# EAGLE design sk6812-24-12ring-out (EAGLE 7.5.0)
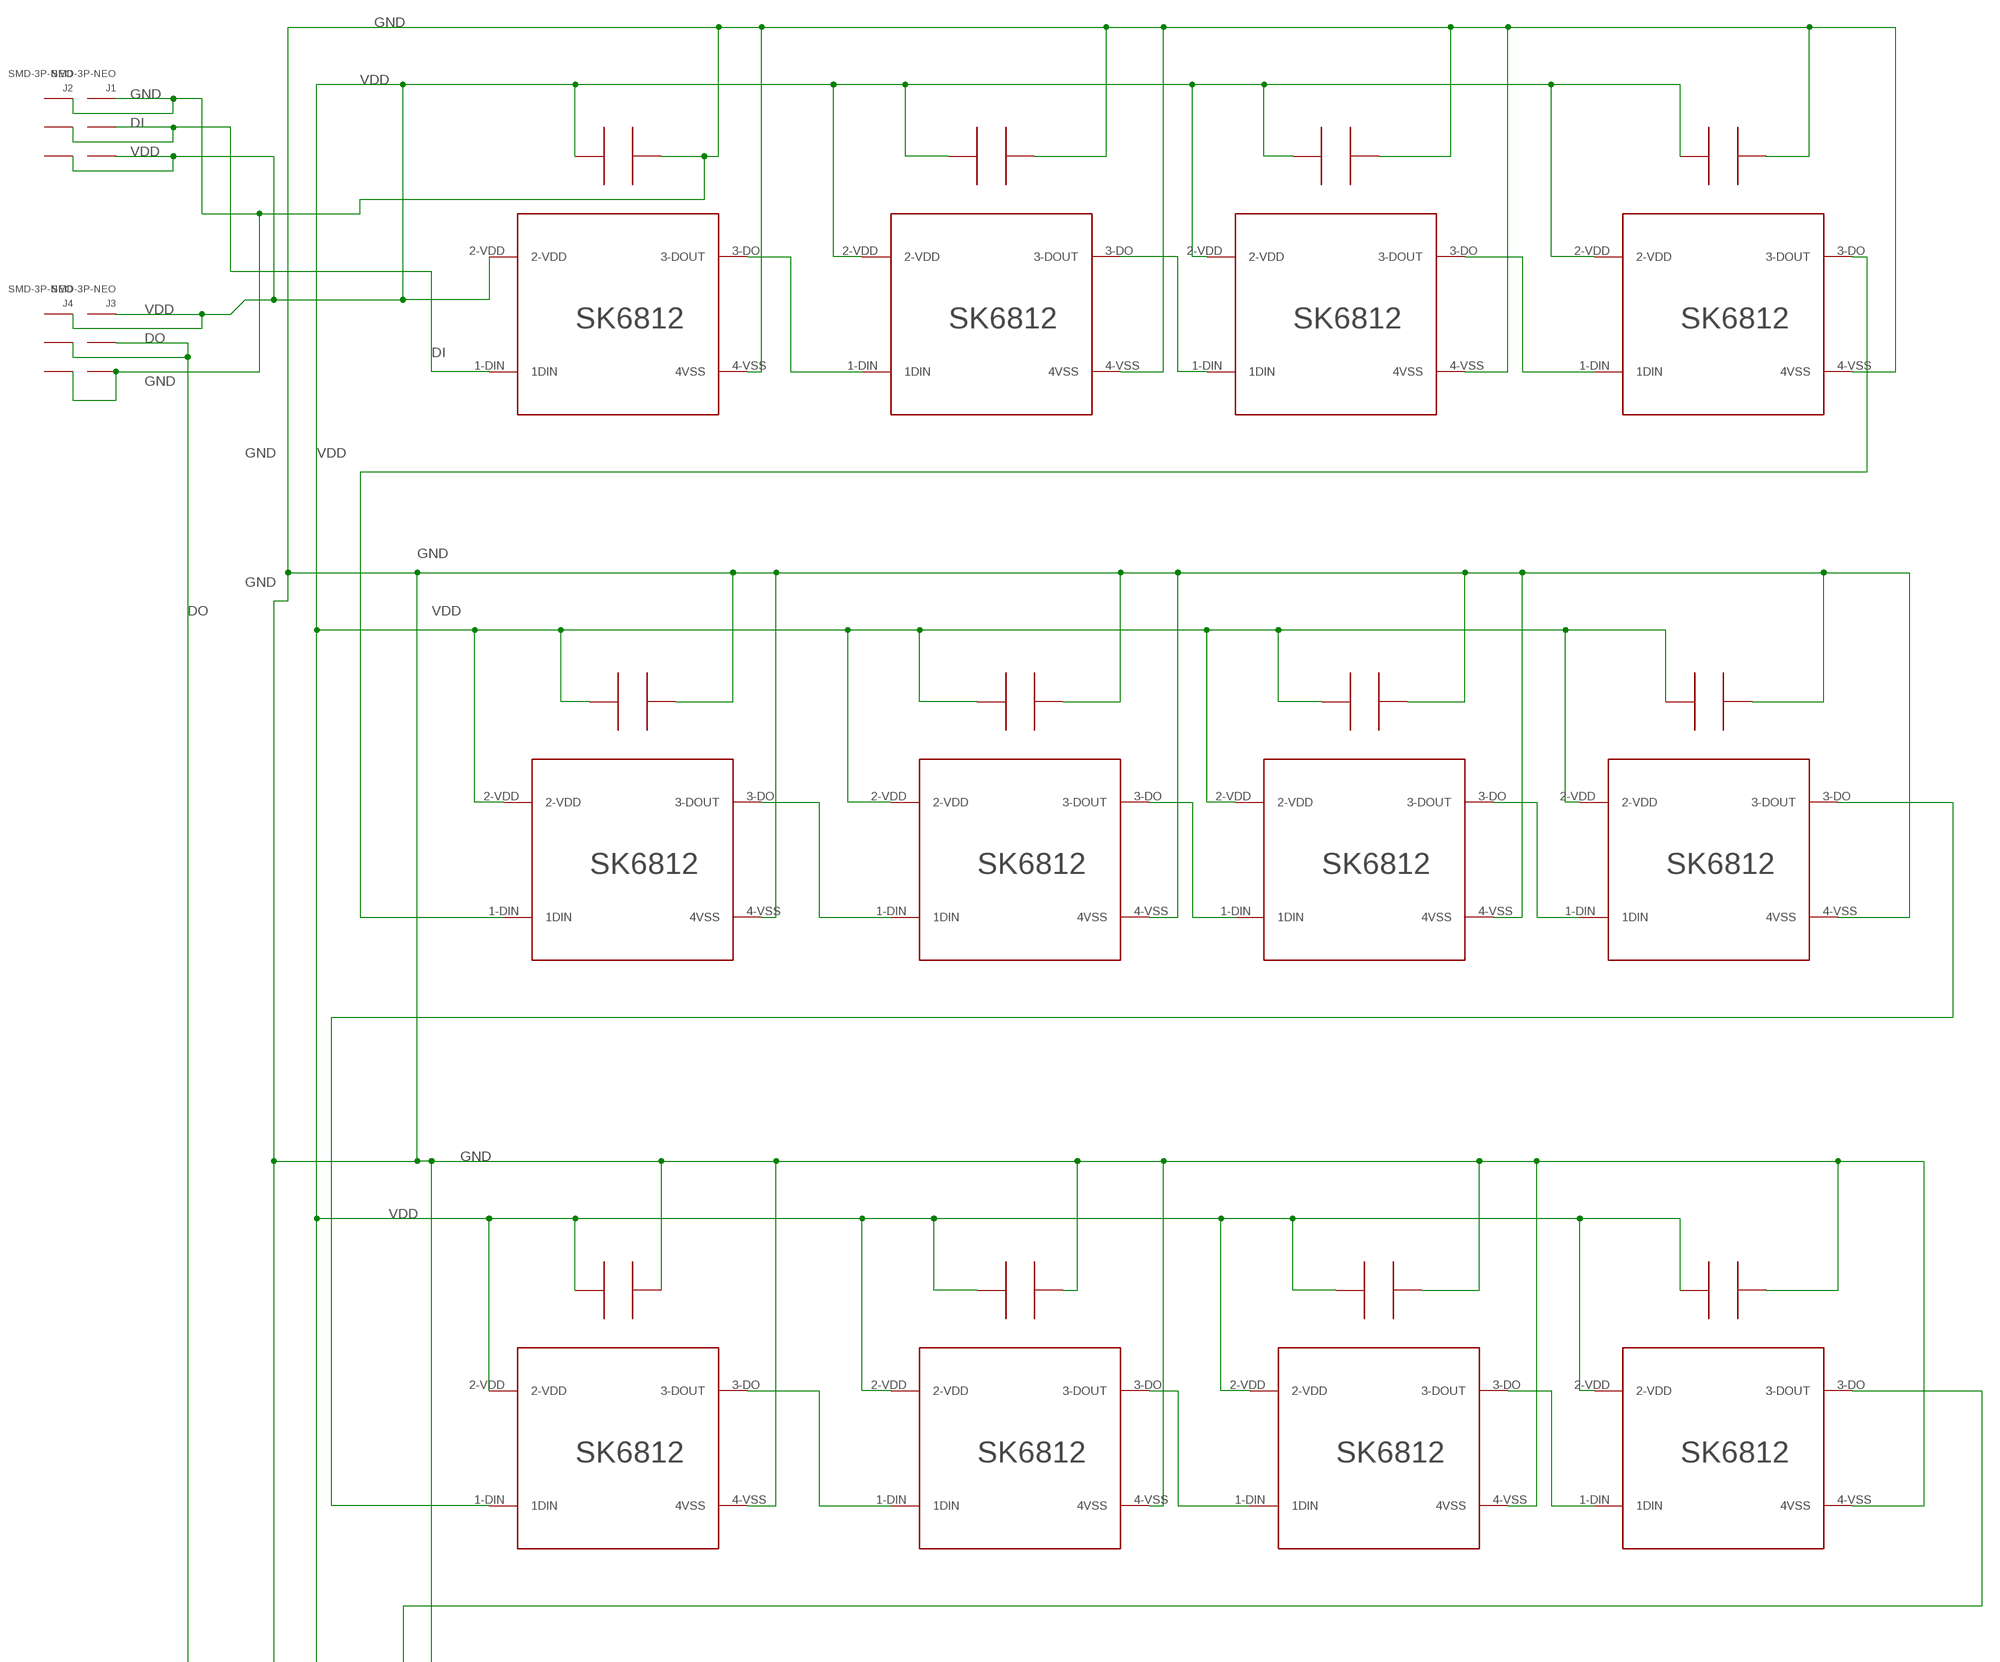
[diagram p0: schematic, sheet 1, part 1 of 2]
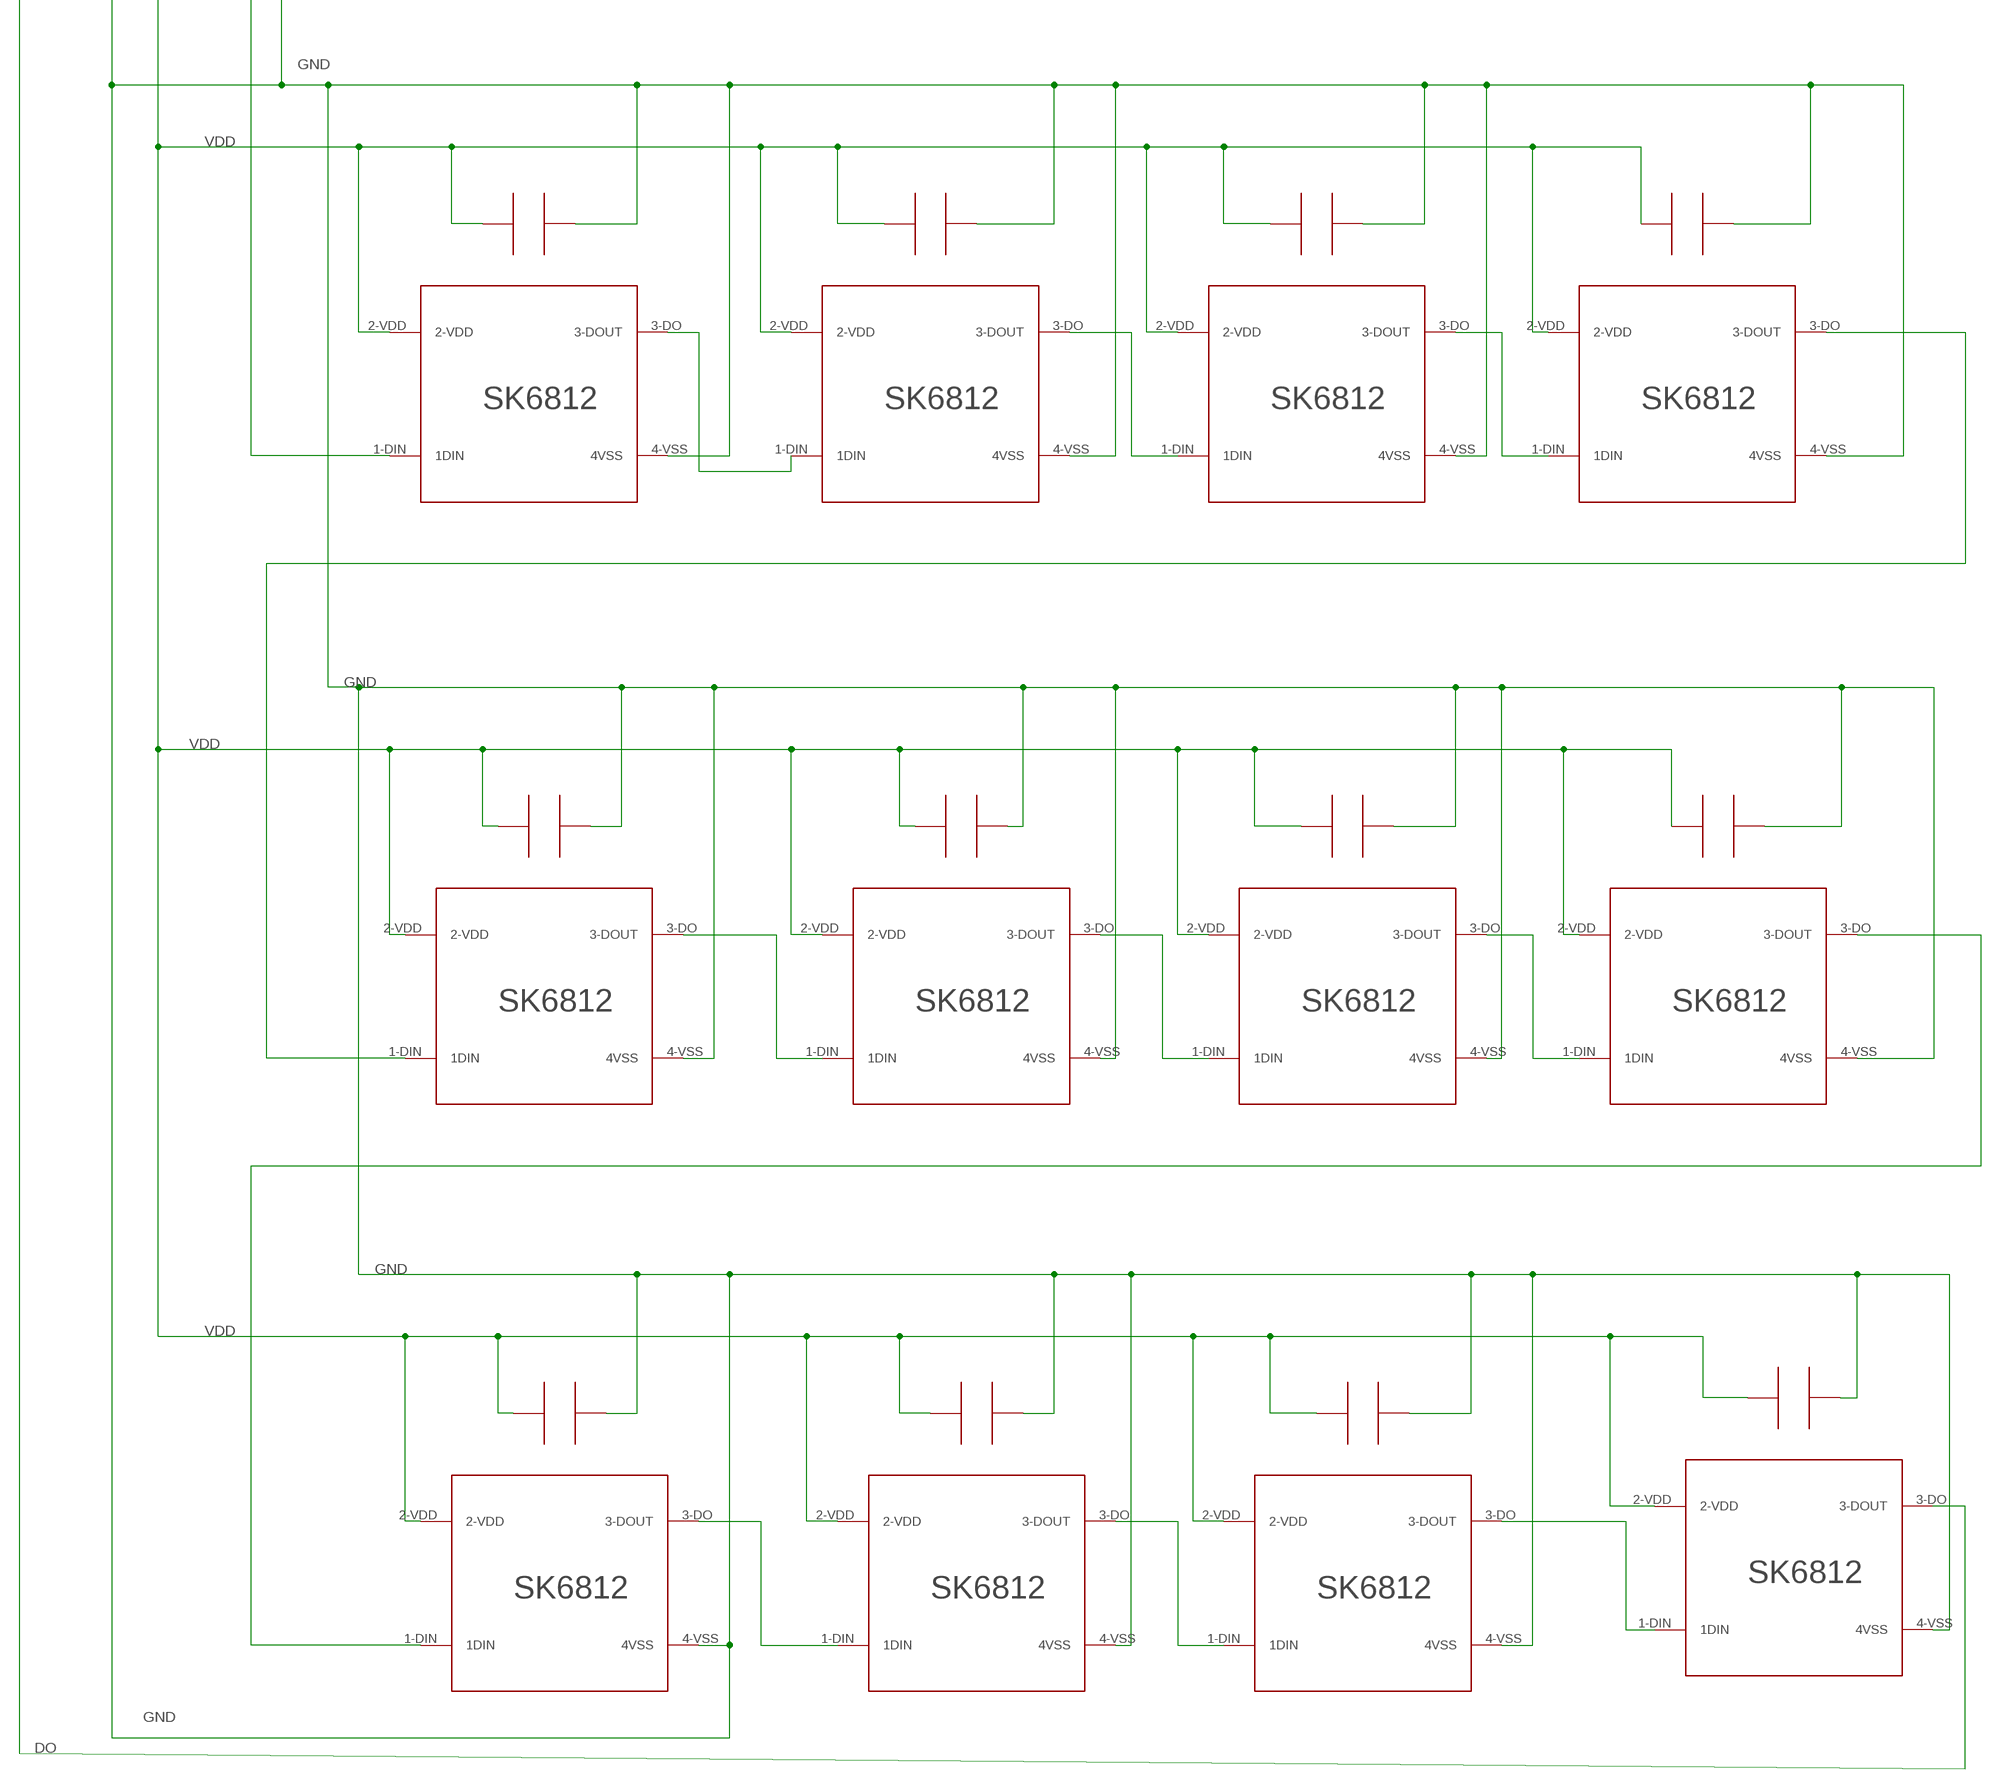
[diagram p1: schematic, sheet 1, part 2 of 2]

## Parts
D1  SK6812-S-C  [SMD4020+0402C]
D2  SK6812-S-C  [SMD4020+0402C]
D3  SK6812-S-C  [SMD4020+0402C]
D4  SK6812-S-C  [SMD4020+0402C]
D5  SK6812-S-C  [SMD4020+0402C]
D6  SK6812-S-C  [SMD4020+0402C]
D7  SK6812-S-C  [SMD4020+0402C]
D8  SK6812-S-C  [SMD4020+0402C]
D9  SK6812-S-C  [SMD4020+0402C]
D10  SK6812-S-C  [SMD4020+0402C]
D11  SK6812-S-C  [SMD4020+0402C]
D12  SK6812-S-C  [SMD4020+0402C]
D13  SK6812-S-C  [SMD4020+0402C]
D14  SK6812-S-C  [SMD4020+0402C]
D15  SK6812-S-C  [SMD4020+0402C]
D16  SK6812-S-C  [SMD4020+0402C]
D17  SK6812-S-C  [SMD4020+0402C]
D18  SK6812-S-C  [SMD4020+0402C]
D19  SK6812-S-C  [SMD4020+0402C]
D20  SK6812-S-C  [SMD4020+0402C]
D21  SK6812-S-C  [SMD4020+0402C]
D22  SK6812-S-C  [SMD4020+0402C]
D23  SK6812-S-C  [SMD4020+0402C]
D24  SK6812-S-C  [SMD4020+0402C]
J1  SMD-3P-NEO  [SMD-3P-2.0]
J2  SMD-3P-NEO  [SMD-3P-2.0]
J3  SMD-3P-NEO  [SMD-3P-2.0]
J4  SMD-3P-NEO  [SMD-3P-2.0]

## Nets
DI: D1.1-DIN(1DIN) J1.P$2 J2.P$2
DO: D24.3-DO(3-DOUT) J3.P$2 J4.P$2
DO01: D1.3-DO(3-DOUT) D2.1-DIN(1DIN)
DO02: D2.3-DO(3-DOUT) D3.1-DIN(1DIN)
DO03: D3.3-DO(3-DOUT) D4.1-DIN(1DIN)
DO04: D4.3-DO(3-DOUT) D5.1-DIN(1DIN)
DO05: D5.3-DO(3-DOUT) D6.1-DIN(1DIN)
DO06: D6.3-DO(3-DOUT) D7.1-DIN(1DIN)
DO07: D7.3-DO(3-DOUT) D8.1-DIN(1DIN)
DO08: D8.3-DO(3-DOUT) D9.1-DIN(1DIN)
DO10: D10.3-DO(3-DOUT) D11.1-DIN(1DIN)
DO11: D11.3-DO(3-DOUT) D12.1-DIN(1DIN)
DO12: D12.3-DO(3-DOUT) D13.1-DIN(1DIN)
DO13: D13.3-DO(3-DOUT) D14.1-DIN(1DIN)
DO14: D14.3-DO(3-DOUT) D15.1-DIN(1DIN)
DO15: D15.3-DO(3-DOUT) D16.1-DIN(1DIN)
DO16: D16.3-DO(3-DOUT) D17.1-DIN(1DIN)
DO18: D18.3-DO(3-DOUT) D19.1-DIN(1DIN)
DO19: D19.3-DO(3-DOUT) D20.1-DIN(1DIN)
DO20: D20.3-DO(3-DOUT) D21.1-DIN(1DIN)
DO21: D21.3-DO(3-DOUT) D22.1-DIN(1DIN)
DO23: D23.3-DO(3-DOUT) D24.1-DIN(1DIN)
GND: D1.4-VSS(4VSS) D1.5-C-VSS(C-VSS) D2.4-VSS(4VSS) D2.5-C-VSS(C-VSS) D3.4-VSS(4VSS) D3.5-C-VSS(C-VSS) D4.4-VSS(4VSS) D4.5-C-VSS(C-VSS) D5.4-VSS(4VSS) D5.5-C-VSS(C-VSS) D6.4-VSS(4VSS) D6.5-C-VSS(C-VSS) D7.4-VSS(4VSS) D7.5-C-VSS(C-VSS) D8.4-VSS(4VSS) D8.5-C-VSS(C-VSS) D9.4-VSS(4VSS) D9.5-C-VSS(C-VSS) D10.4-VSS(4VSS) D10.5-C-VSS(C-VSS) D11.4-VSS(4VSS) D11.5-C-VSS(C-VSS) D12.4-VSS(4VSS) D12.5-C-VSS(C-VSS) D13.4-VSS(4VSS) D13.5-C-VSS(C-VSS) D14.4-VSS(4VSS) D14.5-C-VSS(C-VSS) D15.4-VSS(4VSS) D15.5-C-VSS(C-VSS) D16.4-VSS(4VSS) D16.5-C-VSS(C-VSS) D17.4-VSS(4VSS) D17.5-C-VSS(C-VSS) D18.4-VSS(4VSS) D18.5-C-VSS(C-VSS) D19.4-VSS(4VSS) D19.5-C-VSS(C-VSS) D20.4-VSS(4VSS) D20.5-C-VSS(C-VSS) D21.4-VSS(4VSS) D21.5-C-VSS(C-VSS) D22.4-VSS(4VSS) D22.5-C-VSS(C-VSS) D23.4-VSS(4VSS) D23.5-C-VSS(C-VSS) D24.4-VSS(4VSS) D24.5-C-VSS(C-VSS) J1.P$3 J2.P$3 J3.P$1 J4.P$1
N$4: D22.3-DO(3-DOUT) D23.1-DIN(1DIN)
N$7: D17.3-DO(3-DOUT) D18.1-DIN(1DIN)
N$9: D9.3-DO(3-DOUT) D10.1-DIN(1DIN)
VDD: D1.2-VDD D1.6-C-VDD(C-VDD) D2.2-VDD D2.6-C-VDD(C-VDD) D3.2-VDD D3.6-C-VDD(C-VDD) D4.2-VDD D4.6-C-VDD(C-VDD) D5.2-VDD D5.6-C-VDD(C-VDD) D6.2-VDD D6.6-C-VDD(C-VDD) D7.2-VDD D7.6-C-VDD(C-VDD) D8.2-VDD D8.6-C-VDD(C-VDD) D9.2-VDD D9.6-C-VDD(C-VDD) D10.2-VDD D10.6-C-VDD(C-VDD) D11.2-VDD D11.6-C-VDD(C-VDD) D12.2-VDD D12.6-C-VDD(C-VDD) D13.2-VDD D13.6-C-VDD(C-VDD) D14.2-VDD D14.6-C-VDD(C-VDD) D15.2-VDD D15.6-C-VDD(C-VDD) D16.2-VDD D16.6-C-VDD(C-VDD) D17.2-VDD D17.6-C-VDD(C-VDD) D18.2-VDD D18.6-C-VDD(C-VDD) D19.2-VDD D19.6-C-VDD(C-VDD) D20.2-VDD D20.6-C-VDD(C-VDD) D21.2-VDD D21.6-C-VDD(C-VDD) D22.2-VDD D22.6-C-VDD(C-VDD) D23.2-VDD D23.6-C-VDD(C-VDD) D24.2-VDD D24.6-C-VDD(C-VDD) J1.P$1 J2.P$1 J3.P$3 J4.P$3

## Library data of the parts
D1-D24 = hh-led-2017:SK6812-S-C
J1-J4 = hh-led-2017:SMD-3P-NEO

## Board
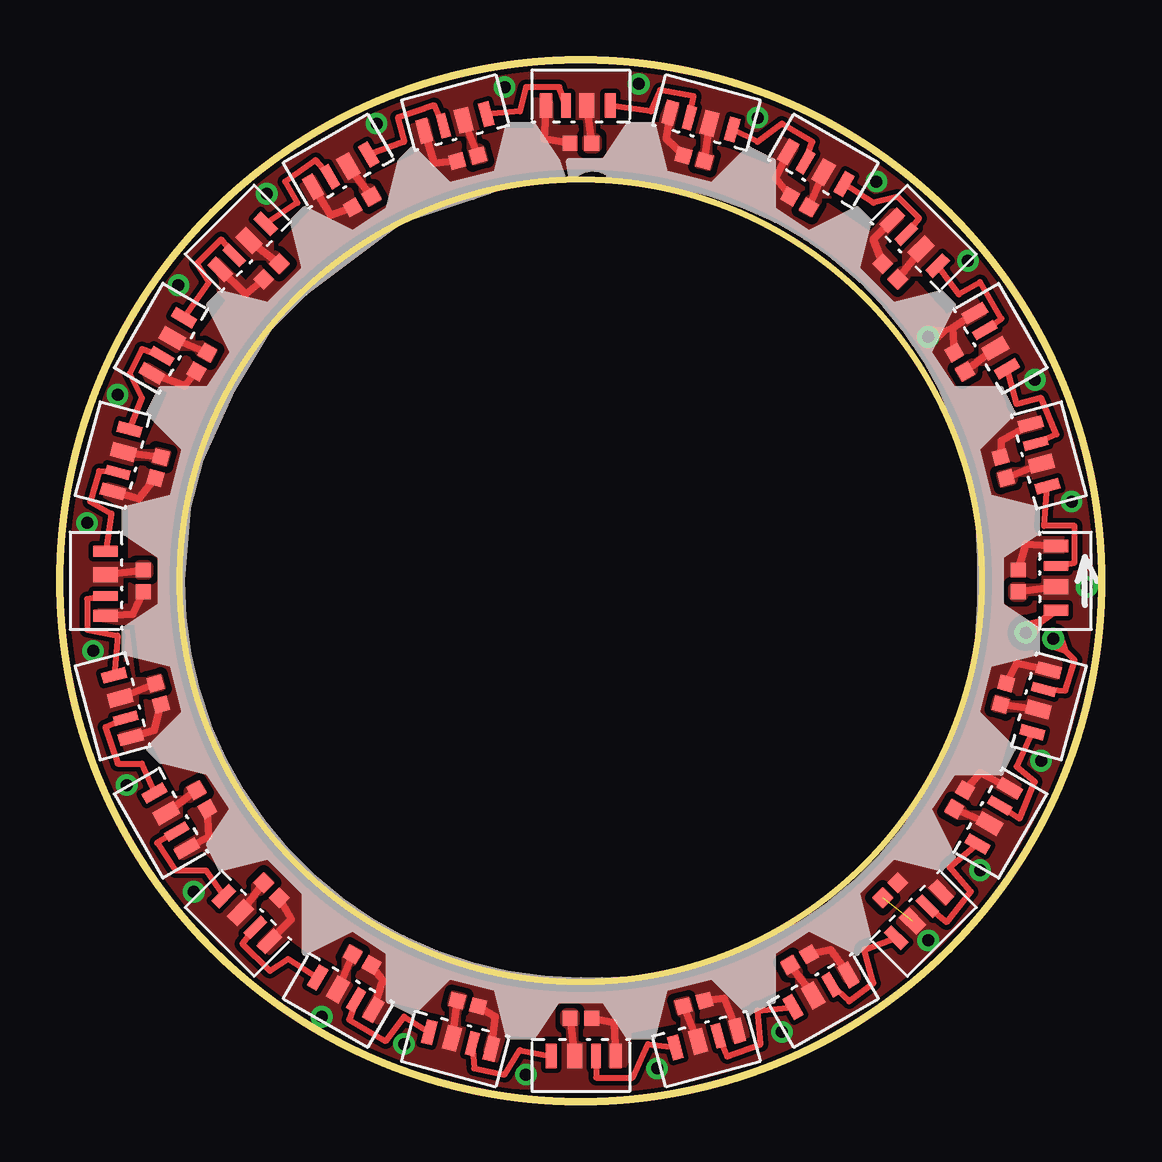
[diagram p2: board, top side]
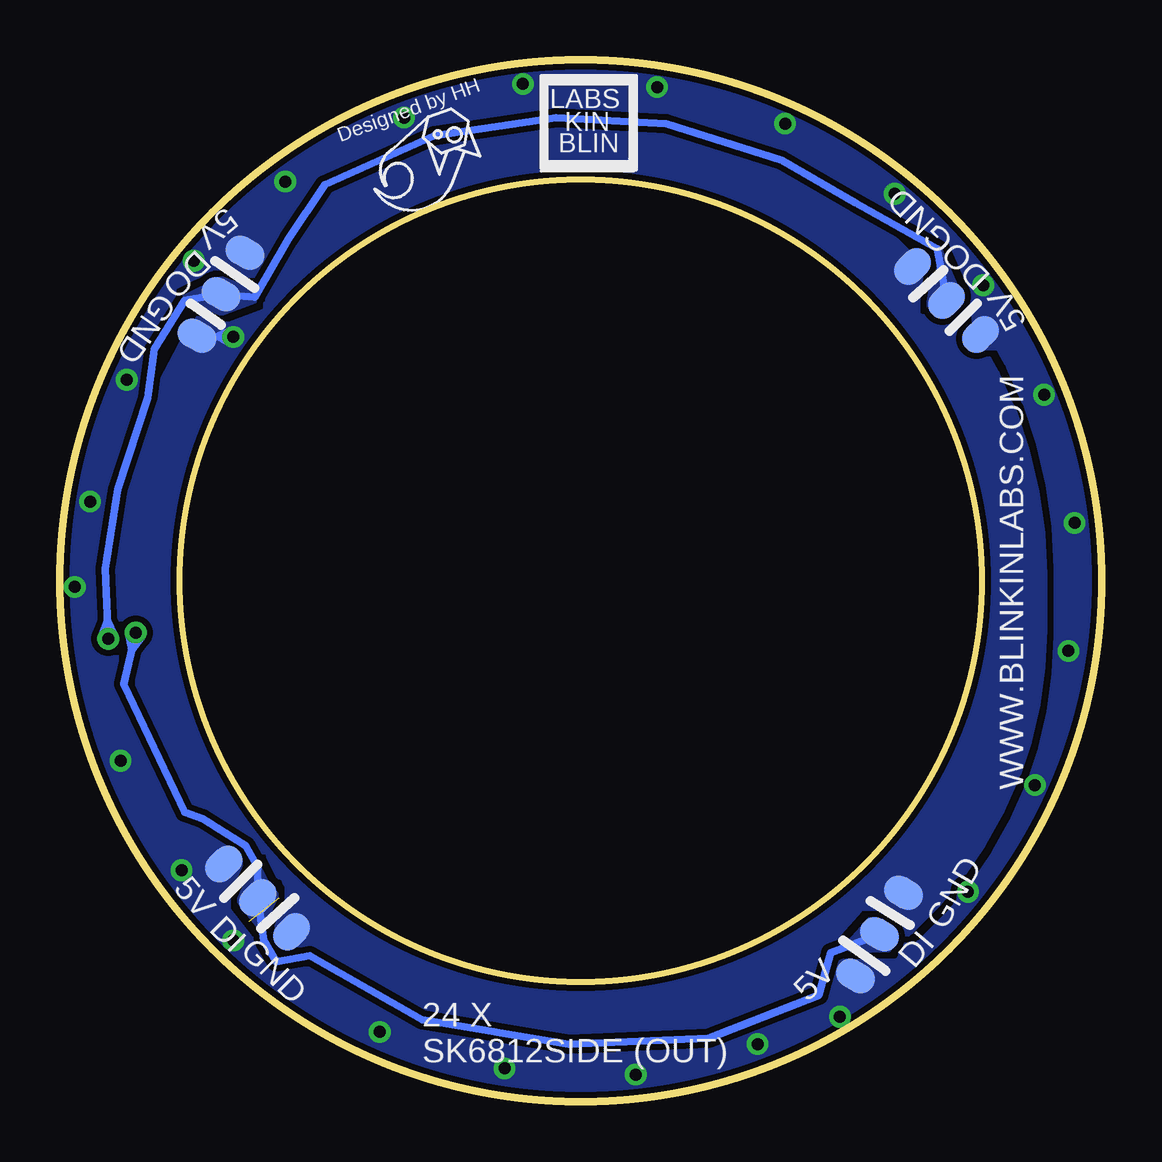
[diagram p3: board, bottom side, seen from below]

Size 43.4 x 43.4 mm. Coordinates in mm from the lower left corner, seen from the top.
Outline: circle at 21.7,21.7 radius 21.7
Outline: circle at 21.7,21.7 radius 16.7
Outline: circle at 21.7,21.7 radius 21.7
Copper layers (1*16): Top 0.035mm / dielectric 1.5mm / Bottom 0.035mm
Design rules "default *": minimum track width 10mil, minimum drill 24mil, track to track 5mil, track to pad 5mil, pad to pad 5mil, via to via 5mil, smd to smd 5mil, copper to edge 4mil, drill to drill 8mil, minimum pad ring 10mil, minimum via ring 8mil, stop-mask expansion 4mil, vias tented up to drill 25mil, thermal gap 10mil

### Footprints (pad centres in the part's own frame; a part is rotated, then mirrored left to right if it is on the bottom)
SMD4020+0402C = smd 1.016 x 0.457: 1-DIN -0.3,1.225 | smd 1.016 x 0.61: 2-VDD -0.3,0.25 | smd 1.016 x 0.4: 3-DO -0.3,-0.625 | smd 1.016 x 0.508: 4-VSS -0.3,-1.45 | smd 0.62 x 0.62: 5-C-VSS 1.27,-0.45; 6-C-VDD 1.27,0.45
SMD-3P-2.0 = smd 1.2 x 1.676: P$1 -2,0; P$2 0,0; P$3 2,0

### Placement (x,y rotation side)
D1  41.2,21.7 180 top
D2  40.54,26.75 195 top
D3  38.59,31.45 210 top
D4  35.49,35.49 225 top
D5  31.45,38.59 240 top
D6  26.75,40.54 255 top
D7  21.7,41.2 270 top
D8  16.65,40.54 285 top
D9  11.95,38.59 300 top
D10  7.91,35.49 315 top
D11  4.81,31.45 330 top
D12  2.86,26.75 345 top
D13  2.2,21.7 0 top
D14  2.86,16.65 15 top
D15  4.81,11.95 30 top
D16  7.91,7.91 45 top
D17  11.95,4.81 60 top
D18  16.65,2.86 75 top
D19  21.7,2.2 90 top
D20  26.75,2.86 105 top
D21  31.45,4.81 120 top
D22  35.49,7.91 135 top
D23  38.59,11.95 150 top
D24  40.54,16.65 165 top
J1  35.16,8.49 315 bottom
J2  9.25,6.97 60 bottom
J3  36.69,33.64 60 bottom
J4  6.46,33.38 315 bottom
U$1  [CRAZYCAT(M)]  27.92,39.73 200 bottom
U$2  [LOGO(M)]  20.68,41 180 bottom

### Tracks (layer width: path | path; a pad name or v marks a point on that pad's centre or on a via)
DI  (via drill 0.5 pad 0.25)
  Top 0.305: v40.24,19.54 40.84,19.99 | 40.84,19.99 D1.1-DIN | 40.84,19.99 40.17,19.83 v40.24,19.54 | 40.84,19.99 40.5,19.39 v40.24,19.54
  Bottom 0.305: v40.24,19.54 40.75,17.38 38.21,12.05 37.45,11.79 35.67,10.65 35.16,9.76 J1.P$2 34.91,6.71 34.4,5.82 33,6.08 28.3,3.41 22.21,2.4 16.37,2.65 11.79,4.43 11.29,6.21 J2.P$2 | v40.24,19.54 40.54,19.49 40.41,18.81 40,19.36 v40.24,19.54
  pour Bottom (isolate 0.254, no thermals): 35.2,9.95 35.92,8.36 35.03,7.22 34.4,8.62 34.53,8.87 34.7,8.95
  pour Bottom (isolate 0.254, no thermals): 10.65,6.46 9.63,7.6 8.87,6.97 8.87,6.33 10.4,6.33 10.2,6.2
DO  (via drill 0.5 pad 0.25)
  Top 0.254: D24.3-DO 41.89,17.13 42.27,18.4 41.91,18.76 | 41.91,18.76 v41.38,19.29 | 41.91,18.76 41.69,19.39 v41.38,19.29 | 41.91,18.76 41.28,18.98 v41.38,19.29
  Bottom 0.305: v41.38,19.29 41.51,22.21 41,25.51 39.73,29.32 39.48,31.35 38.21,33.38 J3.P$2 35.29,33.51 33.89,35.92 32.37,38.21 27.8,40.24 22.72,41 18.14,40.75 13.32,39.23 10.27,37.45 6.84,35.54 J4.P$2 | v41.38,19.29 41.11,19.42 41.42,20.04 41.67,19.4 v41.38,19.29
  pour Bottom (isolate 0.254, no thermals): 35.2,33.7 36.69,34.27 38.21,33.51 36.69,32.88 35.29,33.38 35.33,33.58
  pour Bottom (isolate 0.254, no thermals): 6.83,35.45 7.2,33.2 6.2,33.2 5.82,33.38 6.71,35.42
DO01
  Top 0.254: D1.3-DO 42.27,22.46 42.27,23.99 41,23.99 D2.1-DIN
DO02
  Top 0.254: D2.3-DO 41.51,27.8 40.88,29.32 39.86,29.07 D3.1-DIN
DO03
  Top 0.254: D3.3-DO 39.23,32.62 38.34,34.15 37.45,33.64 D4.1-DIN
DO04
  Top 0.254: D4.3-DO 35.8,36.81 34.91,37.7 33.89,37.45 D5.1-DIN
DO05
  Top 0.254: D5.3-DO 31.35,39.99 30.08,40.75 29.07,39.99 D6.1-DIN
DO06
  Top 0.254: D6.3-DO 26.4,41.89 25,42.15 24.62,41.26 D7.1-DIN
DO07
  Top 0.254: D7.3-DO 20.81,42.27 19.41,42.27 19.16,41.26 D8.1-DIN
DO08
  Top 0.254: D8.3-DO 15.6,41.51 14.08,41 14.33,39.99 D9.1-DIN
DO10
  Top 0.254: D10.3-DO 6.71,35.92 5.7,34.91 6.21,34.15 D11.1-DIN
DO11
  Top 0.254: D11.3-DO 3.41,31.35 2.9,30.34 3.41,29.32 D12.1-DIN
DO12
  Top 0.254: D12.3-DO 1.63,26.27 1.25,25 2.14,24.49 D13.1-DIN
DO13
  Top 0.254: D13.3-DO 1.13,20.94 1.13,19.67 2.4,19.41 D14.1-DIN
DO14
  Top 0.254: D14.3-DO 1.89,15.6 2.4,14.08 3.41,14.08 D15.1-DIN
DO15
  Top 0.254: D15.3-DO 4.05,10.78 4.81,9.63 6.08,9.63 D16.1-DIN
DO16
  Top 0.254: D16.3-DO 7.6,6.59 8.75,5.44 9.51,5.95 D17.1-DIN
DO18
  Top 0.254: D18.3-DO 17.25,1.38 18.52,1.13 19.16,2.14 D19.1-DIN
DO19
  Top 0.254: D19.3-DO 22.34,1 23.86,1 24.49,2.4 D20.1-DIN
DO20
  Top 0.254: D20.3-DO 27.8,1.89 29.19,2.4 29.07,3.79 D21.1-DIN
DO21
  Top 0.254: D21.3-DO 32.88,4.17 33.89,4.94 33.51,6.33 D22.1-DIN
DO23
  Top 0.254: D23.3-DO 39.99,11.79 40.62,13.32 39.86,13.95 D24.1-DIN
GND  (via drill 0.5 pad 0.25)
  Top 0.254: 37.19,32.24 36.88,32.12 | 36.88,32.12 v36.18,31.86 | 36.88,32.12 36.21,32.19 v36.18,31.86 | 36.88,32.12 36.41,31.63 v36.18,31.86
  Top 0.305: D1.4-VSS 40.24,23.22 D1.5-C-VSS | D2.5-C-VSS 39.23,27.54 D2.4-VSS | D3.4-VSS 37.19,32.24 D3.5-C-VSS | D4.4-VSS 33.89,35.92 D4.5-C-VSS | D5.5-C-VSS 29.83,38.46 D5.4-VSS | D6.4-VSS 25.26,40.11 D6.5-C-VSS | D7.5-C-VSS 20.18,40.11 D7.4-VSS | D8.5-C-VSS 15.6,39.1 D8.4-VSS | D9.5-C-VSS 11.29,36.94 D9.4-VSS | D10.5-C-VSS 7.73,33.64 D10.4-VSS | D11.5-C-VSS 5.19,29.83 D11.4-VSS | D12.4-VSS 3.29,25.13 D12.5-C-VSS | D13.4-VSS 3.03,20.3 D13.5-C-VSS | D14.4-VSS 3.92,15.48 D14.5-C-VSS | D15.4-VSS 6.21,11.03 D15.5-C-VSS | D16.5-C-VSS 9.63,7.6 D16.4-VSS | D17.5-C-VSS 13.44,5.06 D17.4-VSS | D18.5-C-VSS 18.14,3.54 D18.4-VSS | D19.5-C-VSS 23.1,3.29 D19.4-VSS | D20.5-C-VSS 27.67,4.3 D20.4-VSS | D21.5-C-VSS 32.11,6.33 D21.4-VSS | D23.5-C-VSS 38.34,13.7 D23.4-VSS | D24.5-C-VSS 39.86,18.27 D24.4-VSS
  Bottom 0.254: v36.18,31.86 36.93,31.88 | 36.93,31.88 J3.P$1 | 36.93,31.88 36.31,32.16 v36.18,31.86 | 36.93,31.88 36.33,31.57 v36.18,31.86
  pour Top (isolate 0.3, rank 2, no thermals): 18.4,40.5 19.79,40.5 19.79,42.02 20.68,42.02 20.68,40.75 25,40.75 25.26,41.89 26.02,41.77 25.76,40.5 29.57,38.97 30.21,40.37 30.97,39.99 30.21,38.59 33.77,36.18 34.78,37.32 35.29,36.81 34.27,35.67 36.94,32.75 38.34,33.51 38.72,32.75 37.7,32.11 39.73,28.43 40.88,28.81 41.13,27.92 40.11,27.41 40.75,23.61 42.27,23.61 42.27,22.84 40.75,22.72 40.5,18.65 42.02,18.27 41.77,17.38 40.24,17.76 39.1,13.83 40.37,13.06 39.99,12.3 38.59,13.19 36.56,9.51 37.45,8.49 36.94,8.11 36.05,8.87 32.88,6.21 33.51,5.06 32.88,4.68 32.11,5.7 28.3,3.92 28.81,2.52 28.05,2.14 27.54,3.67 23.73,2.9 23.73,1.38 22.72,1.38 22.72,2.65 18.52,2.78 18.14,1.51 17.51,1.63 17.89,3.16 13.83,4.17 13.06,3.03 12.43,3.54 12.81,4.43 9.51,6.84 8.49,5.95 7.98,6.59 9,7.48 5.95,10.52 4.94,10.02 4.55,10.65 5.7,11.29 3.92,14.84 2.4,14.59 2.14,15.35 3.67,15.86 3.16,19.92 1.38,19.92 1.38,20.68 2.9,20.68 2.9,24.75 1.38,25 1.63,26.02 2.9,25.76 4.55,29.57 3.03,30.34 3.41,30.97 4.68,30.34 6.97,33.38 5.7,34.65 6.46,35.42 7.73,34.15 10.52,37.19 9.89,38.34 10.65,38.84 11.29,37.7 14.84,39.48 14.46,40.88 15.35,41.13 15.86,39.73
  pour Bottom (isolate 0.254, rank 2, no thermals): 22.21,2.65 22.21,2.78 arc90 41,21.57 arc90 22.46,40.75 21.19,40.75 arc90 2.4,21.95 2.4,19.67 arc90 19.41,2.65
N$4
  Top 0.254: D22.3-DO 36.94,7.48 37.96,8.75 37.07,9.76 D23.1-DIN
N$7
  Top 0.254: D17.3-DO 12.05,3.41 13.57,2.52 14.33,3.54 D18.1-DIN
N$9
  Top 0.254: D9.3-DO 10.65,39.23 9.38,38.34 9.89,37.45 D10.1-DIN
VDD  (via drill 0.5 pad 0.25)  (1 unrouted)
  Top 0.305: D1.2-VDD D1.6-C-VDD | D2.2-VDD D2.6-C-VDD | D3.2-VDD D3.6-C-VDD | D4.2-VDD D4.6-C-VDD | D5.2-VDD D5.6-C-VDD | D6.2-VDD D6.6-C-VDD | D7.2-VDD D7.6-C-VDD | D8.2-VDD D8.6-C-VDD | D9.2-VDD D9.6-C-VDD | D10.2-VDD D10.6-C-VDD | D11.2-VDD D11.6-C-VDD | D12.2-VDD D12.6-C-VDD | D13.2-VDD D13.6-C-VDD | D14.2-VDD D14.6-C-VDD | D15.2-VDD D15.6-C-VDD | D16.2-VDD D16.6-C-VDD | D17.6-C-VDD D17.2-VDD | D18.2-VDD D18.6-C-VDD | D19.6-C-VDD D19.2-VDD | D20.6-C-VDD D20.2-VDD | D21.2-VDD D21.6-C-VDD | D23.2-VDD D23.6-C-VDD | D24.2-VDD D24.6-C-VDD
  other vias: 29.07,41 24.11,42.4 18.52,42.27 13.19,40.75 8.62,37.83 4.94,34.02 2.4,29.45 1.13,24.11 1.38,18.78 2.78,13.19 5.57,8.75 10.9,3.54 14.33,2.4 19.41,1.13 24.88,1.38 30.08,2.9 36.18,6.71 38.34,9.63 40.88,14.21 42.78,21.45 42.15,25 40.62,30.08 37.83,35.03 34.02,38.34
  pour Top (isolate 0.2, rank 4, no thermals): 21.19,43.29 arc-90 43.54,20.94 43.29,20.94 arc-90 22.72,0.36 20.56,0.49 arc-90 0.24,20.81 0.36,22.72 arc-90 20.05,43.29
  pour Bottom (isolate 0.254, rank 4, no thermals): 21.95,43.54 arc-90 43.42,22.08 43.42,18.78 arc-90 24.49,-0.14 20.68,0.24 arc-90 0.36,20.56 -0.14,23.48 arc-90 19.92,43.54

### Text on the board
bPlace: 5V | GND | DO | DO | GND | 5V | WWW.BLINKINLABS.COM | 5V | GND | GND | DI | DI | 5V | 24 X / SK6812SIDE (OUT)